# Altium schematic sheet Power.SchDoc
size A; Organization: Smart Product Design Lab; Address1: 201 Thornton; Address2: Stanford University; Address3: Stanford, CA; Address4: 94305-4021
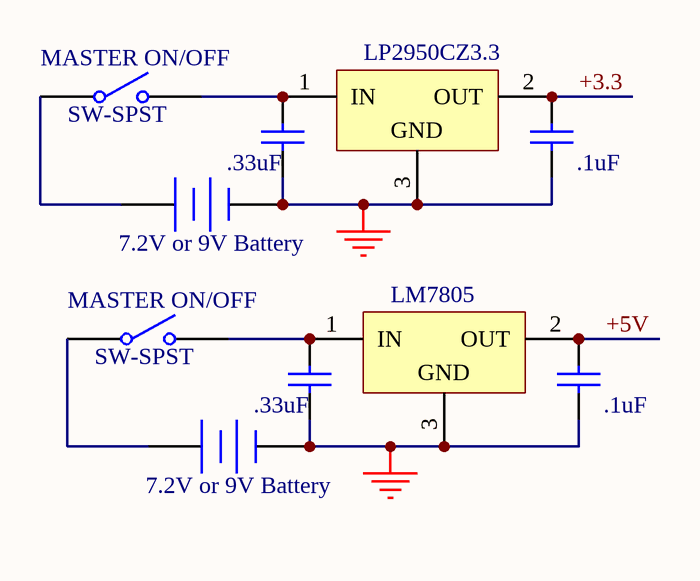
[diagram p0: Power.SchDoc]

## Parts
(Parts that share a designator on the sheet are numbered #1, #2 ... from top to bottom, then left to right.)
BT?#1  7.2V or 9V Battery  [BAT-2]
BT?#2  7.2V or 9V Battery  [BAT-2]
C?#1  value .33uF  [RAD-0.3]  (hidden comment: Cap)
C?#2  value .1uF  [RAD-0.3]  (hidden comment: Cap)
C?#3  value .33uF  [RAD-0.3]  (hidden comment: Cap)
C?#4  value .1uF  [RAD-0.3]  (hidden comment: Cap)
MASTER_ON/OFF#1  SW-SPST  [SPST-2]
MASTER_ON/OFF#2  SW-SPST  [SPST-2]
U?#1  LP2950CZ3.3  [CAN-3/Y1.4]
U?#2  LM7805  [CAN-3/Y1.4]

## Nets
GND: BT?#1.2(-) BT?#2.2(-) C?#1.1 C?#2.1 C?#3.1 C?#4.1 U?#1.3(GND) U?#2.3(GND)
+3.3: C?#2.2 U?#1.2(OUT)
+5V: C?#4.2 U?#2.2(OUT)
NetBT?#1_1: BT?#1.1(+) MASTER_ON/OFF#1.1(COMMON)
NetBT?#2_1: BT?#2.1(+) MASTER_ON/OFF#2.1(COMMON)
NetC?#1_2: C?#1.2 MASTER_ON/OFF#1.2(NO) U?#1.1(IN)
NetC?#3_2: C?#3.2 MASTER_ON/OFF#2.2(NO) U?#2.1(IN)

## Notes on the sheet
- Title
- Size:
- Date:
- File:
- A
- Number:
- Time:
- Revision:
- Sheet
- of
- Drawn By:

## Library data of the parts
BT?#1 BT?#2 = Battery: Multicell Battery; Manufacturer: Generic Components; Published: 1999
C?#1-C?#4 = Cap: Capacitor; Manufacturer: Generic Components; Class: Passive; Published: 08/06/2000; Publisher: Altium Hobart Technology Centre; SubClass: Capacitor
MASTER_ON/OFF#1 MASTER_ON/OFF#2 = SW-SPST: Single-Pole, Single-Throw Switch; Manufacturer: Generic Components; Published: 1999
U?#1 U?#2 = LM78M05CH: 3-Terminal Positive Voltage Regulator; Manufacturer: National Semiconductor; Class: Power Management; Note: Case is connected to GND; Published: 15/04/2002; Publisher: Altium Hobart Technology Centre; SubClass: Voltage Regulator